# EAGLE design bombclock_1.3 (EAGLE 7.3.0)
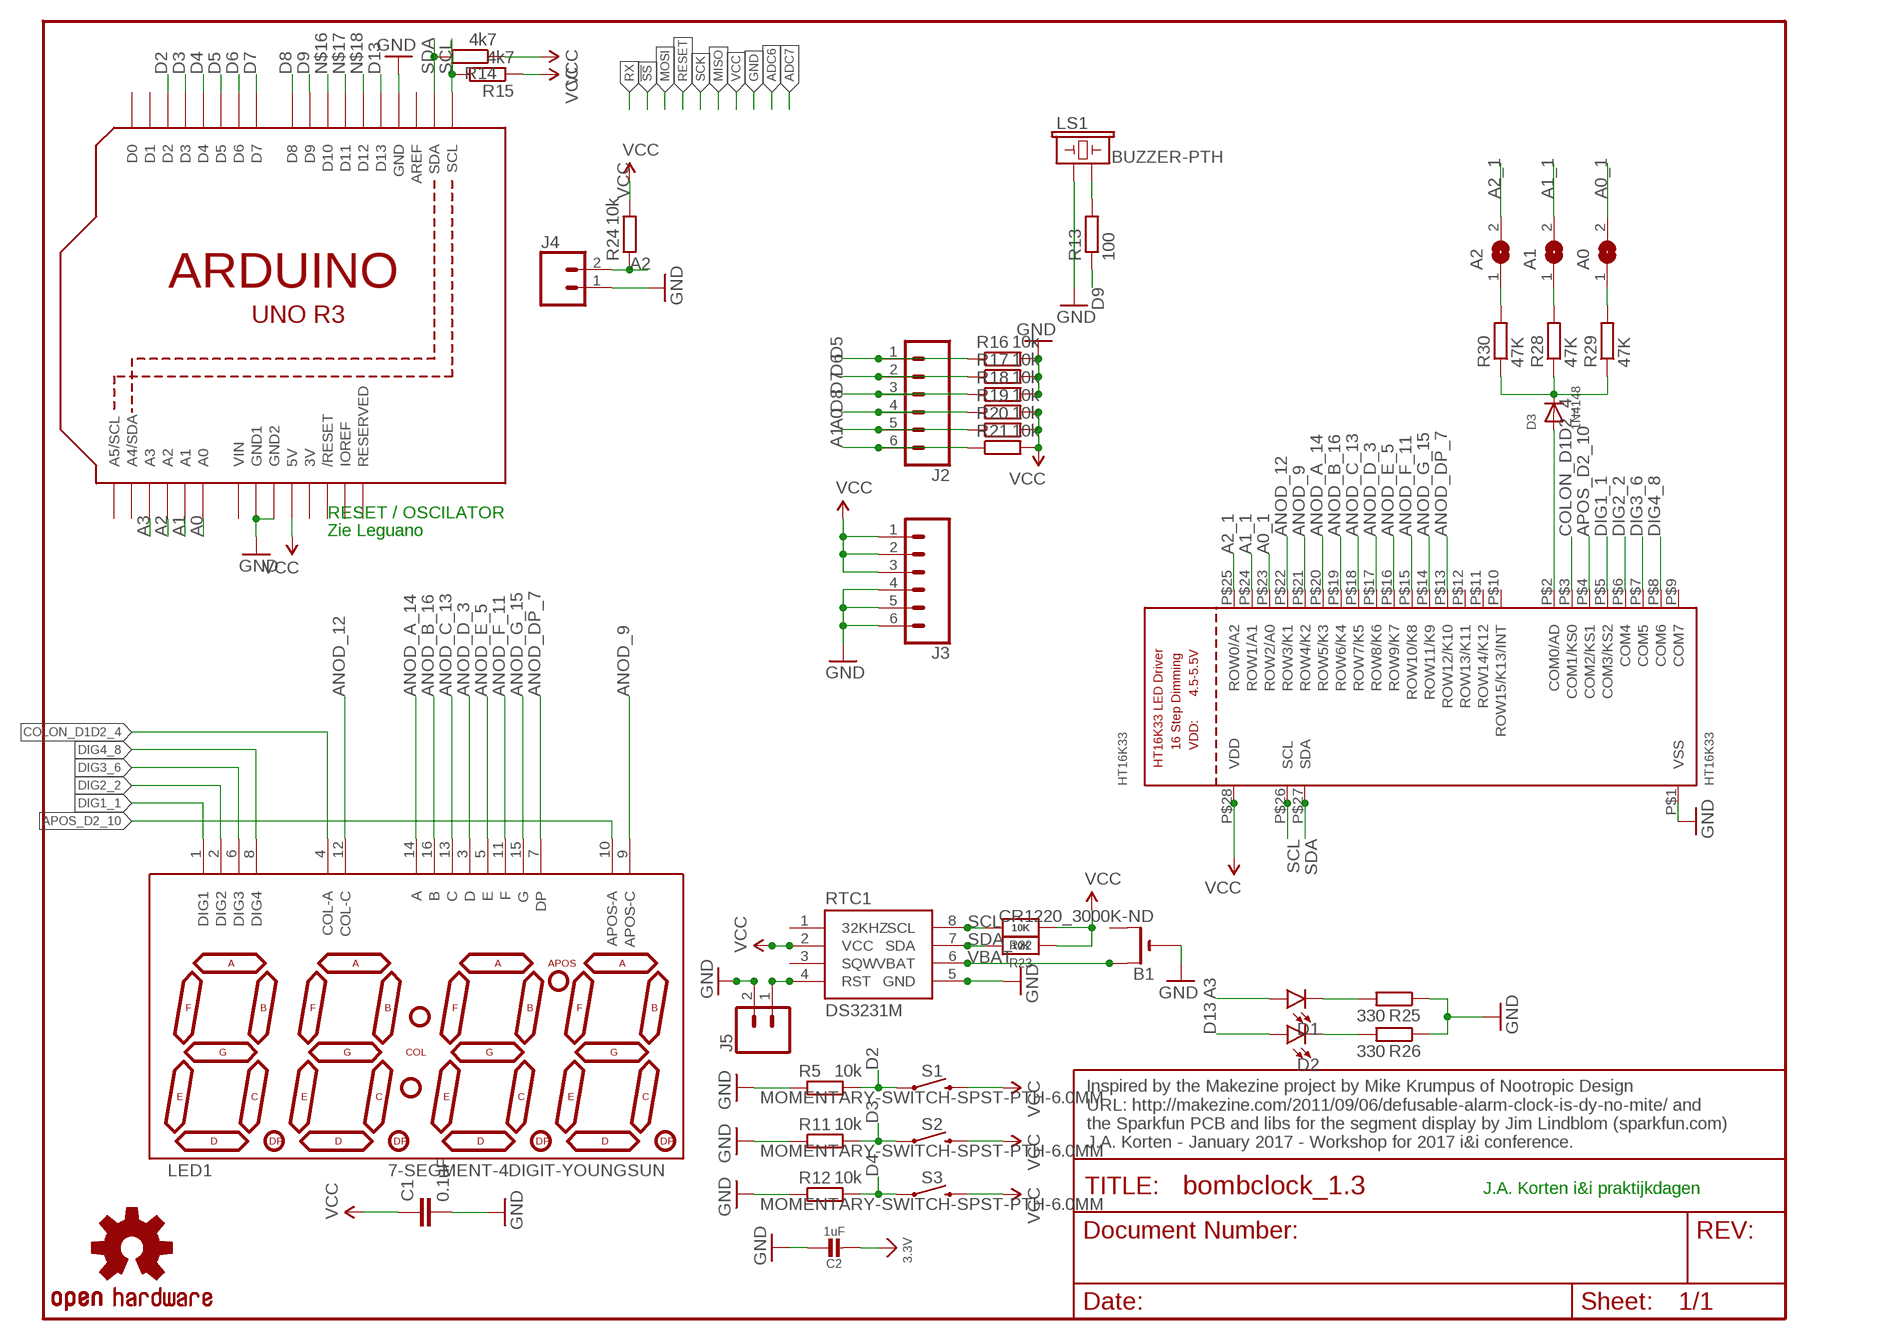
[diagram p0: schematic, sheet 1]

## Parts
A0  SOLDERJUMPERREFLOW_NOPASTE  [SOLDERJUMPER_REFLOW_NOPASTE]
A1  SOLDERJUMPERREFLOW_NOPASTE  [SOLDERJUMPER_REFLOW_NOPASTE]
A2  SOLDERJUMPERREFLOW_NOPASTE  [SOLDERJUMPER_REFLOW_NOPASTE]
B1  CR1220_3000K-ND  CR1220SMT  [CR1220-SMD]
C1  0.1uF  CAP0402-CAP  [0402-CAP]
C2  1uF  CAP_CERAMIC0805-NOOUTLINE  [0805-NO]
D1  LED5MM  [LED_5MM]
D2  LED5MM  [LED_5MM]
D3  1N4148  DIODESOD-323F  [SOD-323F]
HT16K33  HT16K33  HT16K33_SOP28  [SOP28_300MIL]
J2  CONN_06SILK_FEMALE_PTH  [1X06]
J3  CONN_06SILK_FEMALE_PTH  [1X06]
J4  CONN_02  [1X02]
J5  CONN_02  [1X02]
LED1  7-SEGMENT-4DIGIT-YOUNGSUN  [7-SEGMENT-4DIGIT-YOUNGSUN]
LS1  BUZZER-PTH  [BUZZER-12MM]
R5  10k  R-EU_R0603  [R0603]
R11  10k  R-EU_R0603  [R0603]
R12  10k  R-EU_R0603  [R0603]
R13  100  R-EU_R0603  [R0603]
R14  4k7  R-EU_R0603  [R0603]
R15  4k7  R-EU_R0603  [R0603]
R16  10k  R-EU_R0603  [R0603]
R17  10k  R-EU_R0603  [R0603]
R18  10k  R-EU_R0603  [R0603]
R19  10k  R-EU_R0603  [R0603]
R20  10k  R-EU_R0603  [R0603]
R21  10k  R-EU_R0603  [R0603]
R22  10K  RESISTOR0805_NOOUTLINE  [0805-NO]
R23  10K  RESISTOR0805_NOOUTLINE  [0805-NO]
R24  10k  R-EU_R0603  [R0603]
R25  330  R-EU_R0603  [R0603]
R26  330  R-EU_R0603  [R0603]
R28  47K  R-EU_R0603  [R0603]
R29  47K  R-EU_R0603  [R0603]
R30  47K  R-EU_R0603  [R0603]
RTC1  DS3231M  [SO08]
S1  MOMENTARY-SWITCH-SPST-PTH-6.0MM  [TACTILE_SWITCH_PTH_6.0MM]
S2  MOMENTARY-SWITCH-SPST-PTH-6.0MM  [TACTILE_SWITCH_PTH_6.0MM]
S3  MOMENTARY-SWITCH-SPST-PTH-6.0MM  [TACTILE_SWITCH_PTH_6.0MM]
U1  ARDUINOR3-DIMENSION  [ARDUINOR3]
U$4  OSHW-LOGOS  [OSHW-LOGO-S]

## Nets
3.3V: C2.2
A0: J2.5 R20.1 U1.A0
A0_1: A0.2 HT16K33.P$23(ROW2/A0)
A1: J2.6 R21.1 U1.A1
A1_1: A1.2 HT16K33.P$24(ROW1/A1)
A2: J4.2 R24.1 U1.A2
A2_1: A2.2 HT16K33.P$25(ROW0/A2)
A3: D1.A U1.A3
ANOD_9: HT16K33.P$21(ROW4/K2) LED1.9(APOS-C)
ANOD_12: HT16K33.P$22(ROW3/K1) LED1.12(COL-C)
ANOD_A_14: HT16K33.P$20(ROW5/K3) LED1.14(A)
ANOD_B_16: HT16K33.P$19(ROW6/K4) LED1.16(B)
ANOD_C_13: HT16K33.P$18(ROW7/K5) LED1.13(C)
ANOD_D_3: HT16K33.P$17(ROW8/K6) LED1.3(D)
ANOD_DP_7: HT16K33.P$13(ROW12/K10) LED1.7(DP)
ANOD_E_5: HT16K33.P$16(ROW9/K7) LED1.5(E)
ANOD_F_11: HT16K33.P$15(ROW10/K8) LED1.11(F)
ANOD_G_15: HT16K33.P$14(ROW11/K9) LED1.15(G)
APOS_D2_10: HT16K33.P$4(COM2/KS1) LED1.10(APOS-A)
COLON_D1D2_4: HT16K33.P$3(COM1/KS0) LED1.4(COL-A)
D2: R5.2 S1.1 U1.D2
D3: R11.2 S2.1 U1.D3
D4: R12.2 S3.1 U1.D4
D5: J2.1 R16.1 U1.D5
D6: J2.2 R17.1 U1.D6
D7: J2.3 R18.1 U1.D7
D8: J2.4 R19.1 U1.D8
D9: R13.1 U1.D9
D13: D2.A U1.D13
DIG1_1: HT16K33.P$5(COM3/KS2) LED1.1(DIG1)
DIG2_2: HT16K33.P$6(COM4) LED1.2(DIG2)
DIG3_6: HT16K33.P$7(COM5) LED1.6(DIG3)
DIG4_8: HT16K33.P$8(COM6) LED1.8(DIG4)
GND: B1.- C1.2 C2.1 HT16K33.P$1(VSS) J3.4 J3.5 J3.6 J4.1 J5.2 LS1.+ R5.1 R11.1 R12.1 R16.2 R17.2 R18.2 R25.1 R26.1 RTC1.5(GND) U1.GND U1.GND1 U1.GND2
N$1: A0.1 R29.2
N$7: D3.A HT16K33.P$2(COM0/AD)
N$12: D1.K(C) R25.2
N$14: D2.K(C) R26.2
N$16: U1.D10
N$17: U1.D11
N$18: U1.D12
N$19: A1.1 R28.2
N$20: LS1.- R13.2
N$28: D3.C R28.1 R29.1 R30.1
N$29: A2.1 R30.2
PP: J5.1 RTC1.4(RST)
SCL: HT16K33.P$26(SCL) R15.2 R22.2 RTC1.8(SCL) U1.SCL
SDA: HT16K33.P$27(SDA) R14.2 R23.2 RTC1.7(SDA) U1.SDA
VBAT: B1.+$1(+) RTC1.6(VBAT)
VCC: C1.1 HT16K33.P$28(VDD) J3.1 J3.2 J3.3 R14.1 R15.1 R19.2 R20.2 R21.2 R22.1 R23.1 R24.2 RTC1.2(VCC) S1.3 S2.3 S3.3 U1.5V
Unconnected: B1.+$2(+1) HT16K33.P$9(COM7) HT16K33.P$10(ROW15/K13/INT) HT16K33.P$11(ROW14/K12) HT16K33.P$12(ROW13/K11) RTC1.1(32KHZ) RTC1.3(SQW) U1.A4(A4/SDA) U1.A5(A5/SCL) U1.AREF U1.D0 U1.D1 U1.IOREF U1.RESERVED U1.RESET(/RESET)

## Notes on the sheet
- RESET / OSCILATOR
- Zie Leguano
- Inspired by the Makezine project by Mike Krumpus of Nootropic Design 
  URL: http://makezine.com/2011/09/06/defusable-alarm-clock-is-dy-no-mite/ and 
  the Sparkfun PCB and libs for the segment display by Jim Lindblom (sparkfun.com)
  J.A. Korten - January 2017 - Workshop for 2017 i&i conference.
- J.A. Korten i&i praktijkdagen

## Power pins joined to a net without a drawn wire
3V: U1.3V
VIN: U1.VIN

## Library data of the parts
A0 A1 A2 = microbuilder:SOLDERJUMPER: SMD Solder JUMPER Solder the two pads together to create a connection, or remove the solder to break it. REFLOW - Use this footprint for solder paste and reflow ovens. WAVE - Use this footprint for hand-soldering (larger pads). CLOSED - Has a trace between the two pads to ensure it is closed by default. The trace needs to be cut to disable the jumper, and can be closed again by creating a solder bridge between the two pads.
B1 = adafruit:CR1220: CR1216/CR1220/CR1225 12mm 3V lithium coin cell Great for battery packup. Both SMT and THM holders. Note the THM package has the ground pads on both sides of the PCB so that the masks are the same - this reduces the cost
C1 = SparkFun:CAP: Capacitor Standard 0603 ceramic capacitor, and 0.1" leaded capacitor.
C2 = microbuilder:CAP_CERAMIC: Ceramic Capacitors For new designs, use the packages preceded by an '_' character since they are more reliable: The following footprints should be used on most boards: _0402 - Standard footprint for regular board layouts _0603 - Standard footprint for regular board layouts _0805 - Standard footprint for regular board layouts _1206 - Standard footprint for regular board layouts For extremely tight-pitch boards where space is at a premium, the following 'micro-pitch' footprints can be used (smaller pads, no silkscreen outline, etc.): _0402MP - Micro-pitch footprint for very dense/compact boards _0603MP - Micro-pitch footprint for very dense/compact boards _0805MP - Micro-pitch footprint for very dense/compact boards _1206MP - Micro-pitch footprint for very dense/compact boards
D1 D2 = SparkFun-LED:LED: LED (Generic) Standard schematic elements and footprints for 5mm, 3mm, 1206, and 0603 sized LEDs. Generic LEDs with no color specified.
D3 = adafruit:DIODE: Diode SMADIODE - SMA Surface Mount Package 20V 1A Schottky Diode Digikey: 641-1014-6-ND DO-1N4148 - Through Hole Small Current Diode SOD-123 20V 1 A (.5mV Vf) Schottky Diode - Digikey: MBRX120TPMSCT-ND SOD-323 10V 570mA (.38mV Vf, 3ns) Schottky Diode - Digikey: ZLLS410CT-ND SOD-523 30V 30mA Schottky Diode (RB751S-40TE61) - Digikey: RB751S-40TE61CT-ND SOT23-R/W - SOT23 Package (R = Solder Paste/Reflow Ovens, W = Hand-Soldering) BAT54Film 40V 300mA - Digikey: 497-7162-1-ND
HT16K33 = microbuilder:HT16K33_SOP28
J2 J3 = SparkFun-Connectors:CONN_06: Multi connection point. Often used as Generic Header-pin footprint for 0.1 inch spaced/style header connections On any of the 0.1 inch spaced packages, you can populate with these: Break Away Headers - Straight <https://www.sparkfun.com/products/116> (PRT-00116) Break Away Male Headers - Right Angle <https://www.sparkfun.com/products/553> (PRT-00553) Female Headers <https://www.sparkfun.com/products/115> (PRT-00115) Break Away Headers - Machine Pin <https://www.sparkfun.com/products/117> (PRT-00117) Break Away Female Headers - Swiss Machine Pin <https://www.sparkfun.com/products/743> (PRT-00743) Arduino Stackable Header - 6 Pin <https://www.sparkfun.com/products/9280> (PRT-09280) For SCREWTERMINALS and SPRING TERMINALS visit here: Screw Terimnals on SparkFun.com <https://www.sparkfun.com/search/results?term=Screw+Terminals> (5mm/3.5mm/2.54mm spacing) This device is also useful as a general connection point to wire up your design to another part of your project. Our various solder wires solder well into these plated through hole pads. Hook-Up Wire - Assortment (Stranded, 22 AWG) <https://www.sparkfun.com/products/11375> (PRT-11375) Hook-Up Wire - Assortment (Solid Core, 22 AWG) <https://www.sparkfun.com/products/11367> (PRT-11367) View the entire wire category on our website here <https://www.sparkfun.com/categories/141>; PROD_ID: CONN-08437
J4 J5 = SparkFun-Connectors:CONN_02: Multi connection point. Often used as Generic Header-pin footprint for 0.1 inch spaced/style header connections On any of the 0.1 inch spaced packages, you can populate with these: Break Away Headers - Straight <https://www.sparkfun.com/products/116> (PRT-00116) Break Away Male Headers - Right Angle <https://www.sparkfun.com/products/553> (PRT-00553) Female Headers <https://www.sparkfun.com/products/115> (PRT-00115) Break Away Headers - Machine Pin <https://www.sparkfun.com/products/117> (PRT-00117) Break Away Female Headers - Swiss Machine Pin <https://www.sparkfun.com/products/743> (PRT-00743) For SCREWTERMINALS and SPRING TERMINALS visit here: Screw Terimnals on SparkFun.com <https://www.sparkfun.com/search/results?term=Screw+Terminals> (5mm/3.5mm/2.54mm spacing) This device is also useful as a general connection point to wire up your design to another part of your project. Our various solder wires solder well into these plated through hole pads. Hook-Up Wire - Assortment (Stranded, 22 AWG) <https://www.sparkfun.com/products/11375> (PRT-11375) Hook-Up Wire - Assortment (Solid Core, 22 AWG) <https://www.sparkfun.com/products/11367> (PRT-11367) View the entire wire category on our website here <https://www.sparkfun.com/categories/141> Special notes: Molex polarized connector foot print use with: PRT-08233 with associated crimp pins and housings. 2.54_SCREWTERM for use with PRT-10571. 3.5mm Screw Terminal footprints for PRT-08084 5mm Screw Terminal footprints for use with PRT-08432
LED1 = SparkFun:7-SEGMENT-4DIGIT-YOUNGSUN: This is a part for the 4-Digit 7-segment LEDs from Young Sun. Different from the Digikey LEDs, all 16 pins are used. The LONGPADS Variant is used for a test jig, but you may like it because there is more pad to solder to. If you are concerned about routing space, the standard works just fine though.
LS1 = SparkFun-Electromechanical:BUZZER: Buzzer Small round buzzers that operate around the audible 2kHz range. You can use these as speakers to create simple music or user interfaces. Variant Overview: PTH - Mini Speaker - PC Mount 12mm 2.048kHz <https://www.sparkfun.com/products/7950> PTH_KIT - Mini Speaker - PC Mount 12mm 2.048kHz <https://www.sparkfun.com/products/7950> KIT simplifies soldering by adding stop mask to one side of the pads. PTH_NO_SILK - Mini Speaker - PC Mount 12mm 2.048kHz <https://www.sparkfun.com/products/7950> No silkscreen indicator of buzzer outline. PTH_KIT_NO_SILK - Mini Speaker - PC Mount 12mm 2.048kHz <https://www.sparkfun.com/products/7950> KIT package w/o silkscreen SMD - Buzzer Audio Magnetic (CCV-084B16) SMD buzzer used on, e.g. the LilyPad Buzzer <https://www.sparkfun.com/products/8463> and RFID USB Reader <https://www.sparkfun.com/products/9963>. SMD_KIT - Buzzer Audio Magnetic (CCV-084B16) SMD Buzzer with elongated pins to make soldering easier. Used on the SparkFun Simon Says - Surface Mount Soldering Kit <https://www.sparkfun.com/products/10935>.; PROD_ID: COMP-08253; SF_SKU: COM-07950
R5 R11-R21 R24-R26 = rcl:R-EU_: RESISTOR, European symbol
R22 R23 = microbuilder:RESISTOR: Resistors For new designs, use the packages preceded by an '_' character since they are more reliable: The following footprints should be used on most boards: _0402 - Standard footprint for regular board layouts _0603 - Standard footprint for regular board layouts _0805 - Standard footprint for regular board layouts _1206 - Standard footprint for regular board layouts For extremely tight-pitch boards where space is at a premium, the following 'micro-pitch' footprints can be used (smaller pads, no silkscreen outline, etc.): _0402MP - Micro-pitch footprint for very dense/compact boards _0603MP - Micro-pitch footprint for very dense/compact boards _0805MP - Micro-pitch footprint for very dense/compact boards _1206MP - Micro-pitch footprint for very dense/compact boards
R28-R30 = resistor:R-EU_: RESISTOR, European symbol
RTC1 = SparkFun-Clocks:DS3231M: DS3231M Real Time Clock Accuracy +/-5ppm. Battery Backup. 2.3V to 5.5V. Datasheet <https://cdn.sparkfun.com/datasheets/Dev/Beagle/DS3231M.pdf> SparkFun Products CryptoCape <https://www.sparkfun.com/products/12773> (DEV-12773) SparkFun CryptoShield <https://www.sparkfun.com/products/13183> (DEV-13183); PROD_ID: IC-11985
S1-S3 = SparkFun-Switches:MOMENTARY-SWITCH-SPST: Momentary Switch (Pushbutton) - SPST Normally-open (NO) SPST momentary switches (buttons, pushbuttons). Variants PTH-12MM - 12mm square, through-hole Momentary Pushbutton Switch - 12mm Square <https://www.sparkfun.com/products/9190> (COM-09190) PTH-6.0MM, PTH-6.0MM-KIT - 6.0mm square, through-hole Mini Pushbutton Switch <https://www.sparkfun.com/products/97> (COM-00097) KIT package intended for soldering kit's - only one side of pads' copper is exposed. PTH-RIGHT-ANGLE-KIT - Right-angle, through-hole Right Angle Tactile Button <https://www.sparkfun.com/products/10791> - Used on SparkFun BigTime Watch Kit <https://www.sparkfun.com/products/11734> SMD-12MM - 12mm square, surface-mount Tactile Button - SMD (12mm) <https://www.sparkfun.com/products/12993> (COM-12993) Used on SparkFun PicoBoard <https://www.sparkfun.com/products/11888> SMD-4.5MM - 4.5mm Square Trackball Switch Used on SparkFun Blackberry Trackballer Breakout <https://www.sparkfun.com/products/13169> SMD-4.6MMX2.8MM - 4.60mm x 2.80mm, surface mount Used on SparkFun SAMD21 Mini Breakout <https://www.sparkfun.com/products/13664> SMD-5.2MM, SMD-5.2-REDUNDANT - 5.2mm square, surface-mount Mini Pushbutton Switch - SMD <https://www.sparkfun.com/products/8720> (COM-08720) Used on Arduino Pro Mini <https://www.sparkfun.com/products/11114> REDUNDANT package connects both switch circuits together SMD-6.0X3.5MM - 6.0 x 3.5mm, surface mount Momentary Reset Switch SMD <https://www.sparkfun.com/products/8229> (COM-08229) SMD-6.2MM-TALL - 6.2mm square, surface mount Tactile Button - SMD (6mm) <https://www.sparkfun.com/products/12992> Used on SparkFun Digital Sandbox <https://www.sparkfun.com/products/12651> SMD-RIGHT-ANGLE - Right-angle, surface mount Used on SparkFun Block for Intel® Edison - Arduino <https://www.sparkfun.com/products/13036>; PROD_ID: SWCH-08441; SF_SKU: COM-00097
U1 = adafruit:ARDUINOR3: This is a new object for the new Arduino R3 - with extra pins that you may want to use (such as IOref, and duplicated A4/A5
U$4 = SparkFun-Aesthetics:OSHW-LOGO: Open Source Hardware Logo This logo indicates the piece of hardware it is found on incorporates a OSHW license and/or adheres to the definition of open source hardware found here: http://freedomdefined.org/OSHW

## Board
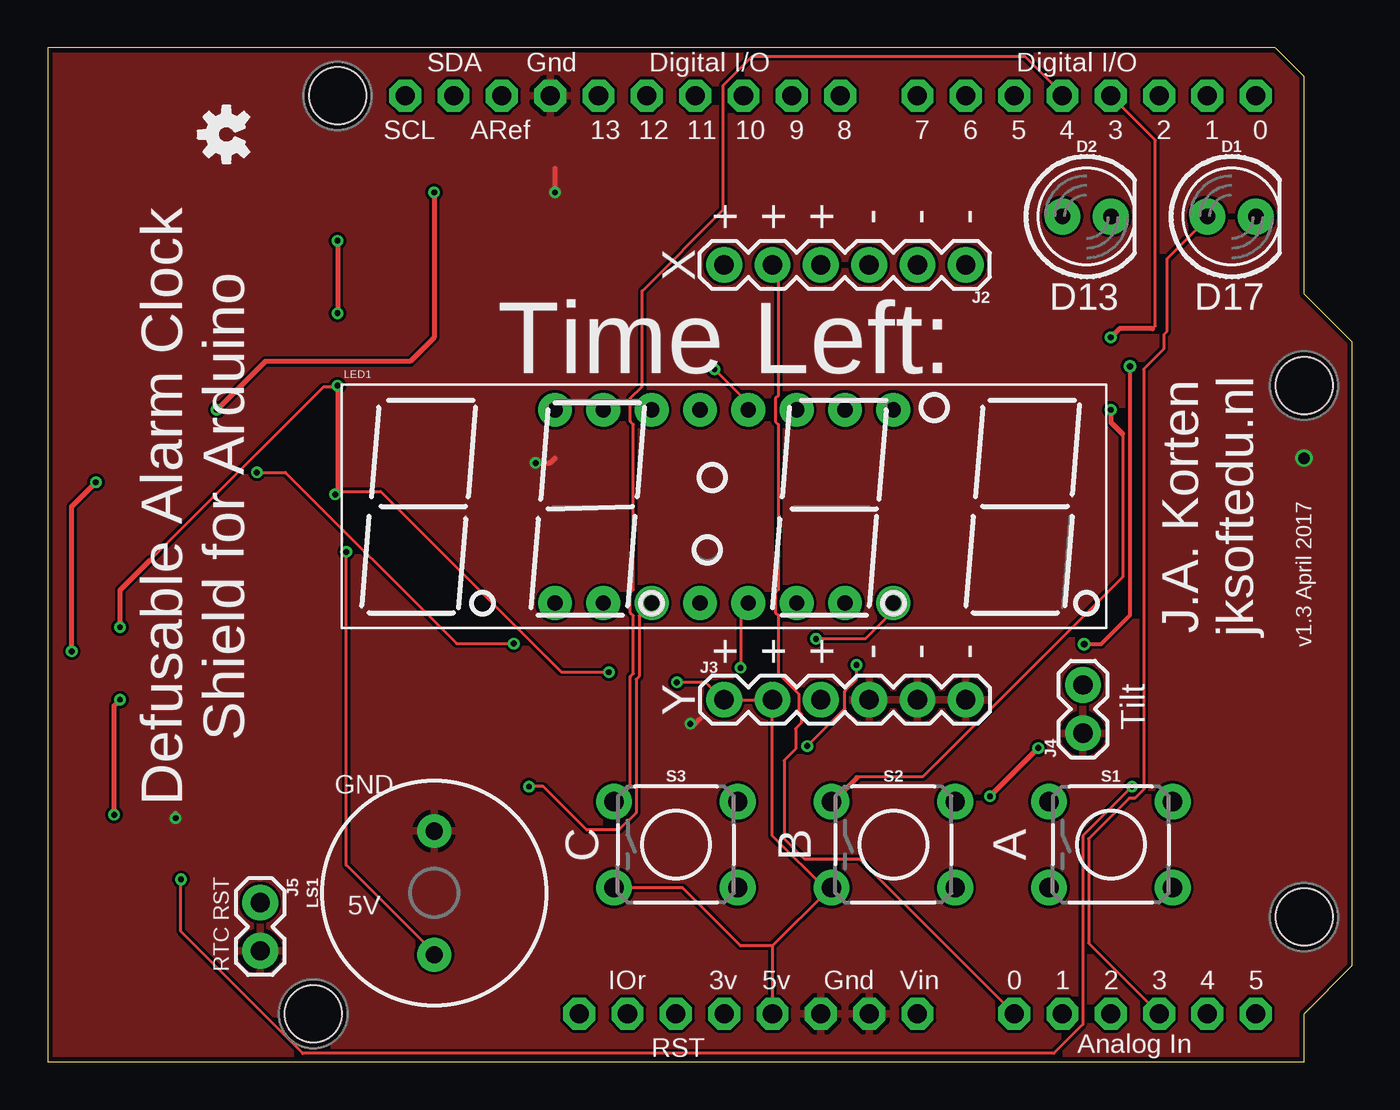
[diagram p1: board, top side]
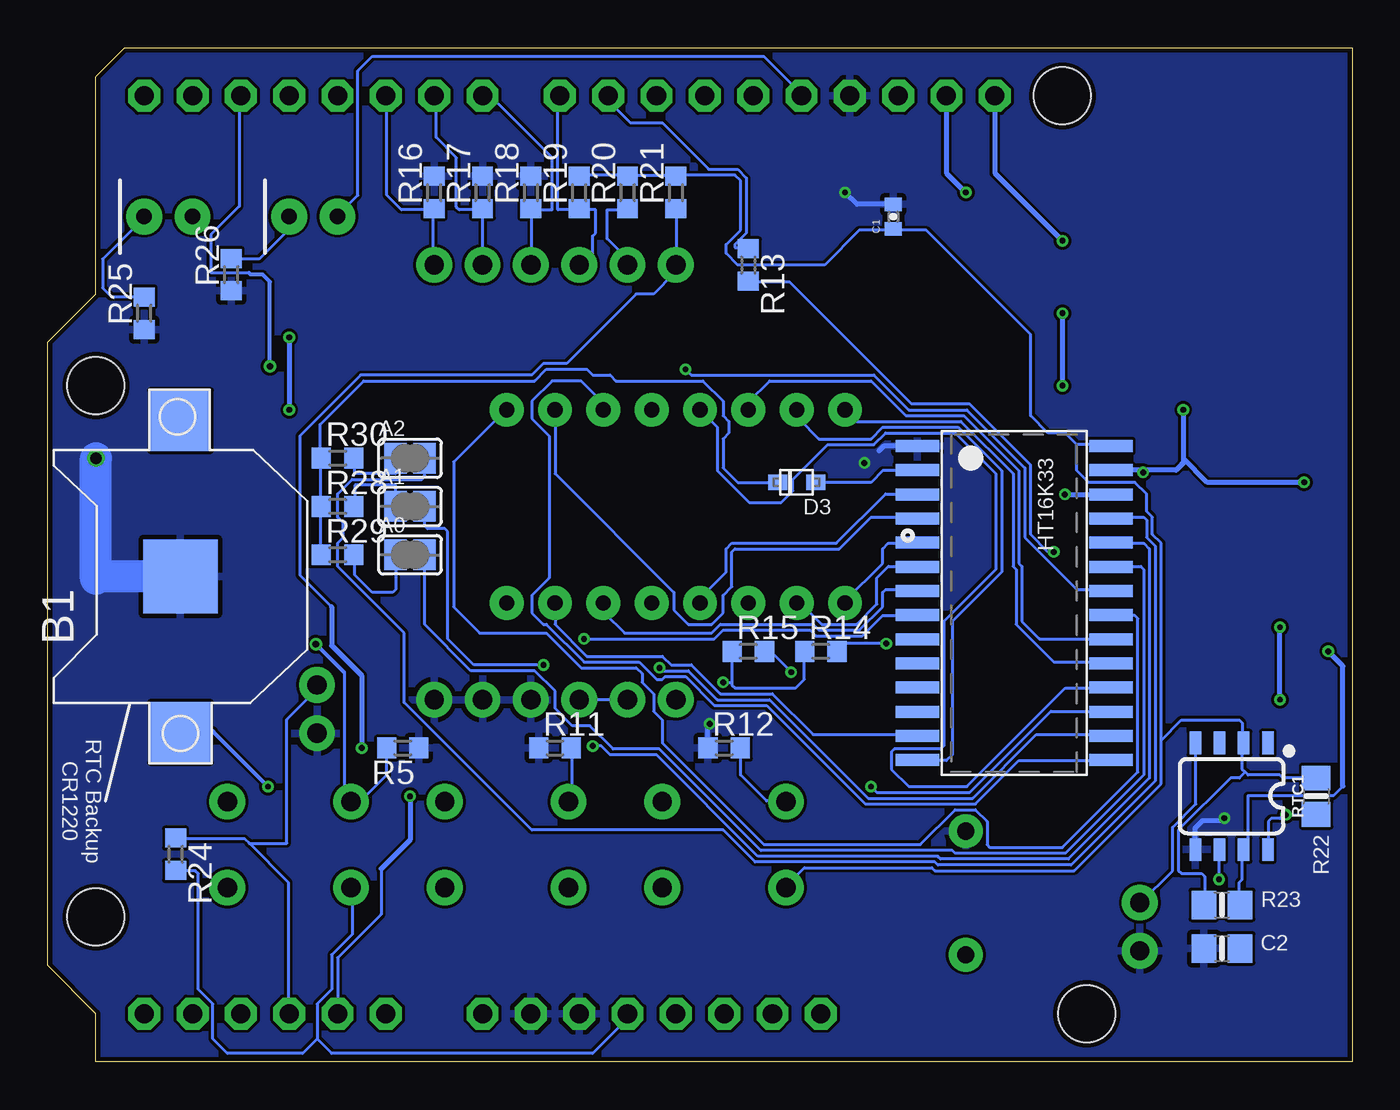
[diagram p2: board, bottom side, seen from below]

Size 68.58 x 53.34 mm. Coordinates in mm from the lower left corner, seen from the top.
Copper layers (1*16): Top 0.035mm / dielectric 1.5mm / Bottom 0.035mm
Design rules "ITEADstudioDRC": minimum track width 6mil, minimum drill 12mil, track to track 6mil, track to pad 6mil, pad to pad 6mil, via to via 6mil, smd to smd 0mil, copper to edge 10mil, drill to drill 10mil, minimum pad ring 10mil, minimum via ring 6mil, stop-mask expansion 2mil, vias tented up to drill 100mil, thermal gap 10mil
Holes 3 mm at 66.04,35.56 66.04,7.62 15.24,50.8 13.97,2.54

### Footprints (pad centres in the part's own frame; a part is rotated, then mirrored left to right if it is on the bottom)
SOLDERJUMPER_REFLOW_NOPASTE = smd 1.168 x 1.6: 1 -0.762,0; 2 0.762,0
CR1220-SMD = smd 3.2 x 3.2: +$1 -8.2,0; +$2 8.2,0 | smd 3.9 x 3.9: - 0,0
0402-CAP = smd 0.7 x 0.9: 1 -0.65,0; 2 0.65,0
0805-NO = smd 1.3 x 1.5: 1 -0.95,0; 2 0.95,0
LED_5MM = drill 0.813 pad 1.88: A -1.27,0; K 1.27,0
SOD-323F = smd 1 x 0.8: A -1,0; C 1,0
SOP28_300MIL = smd 0.635 x 2.286: P$1 -8.255,-5.08; P$2 -6.985,-5.08; P$3 -5.715,-5.08; P$4 -4.445,-5.08; P$5 -3.175,-5.08; P$6 -1.905,-5.08; P$7 -0.635,-5.08; P$8 0.635,-5.08; P$9 1.905,-5.08; P$10 3.175,-5.08; P$11 4.445,-5.08; P$12 5.715,-5.08; P$13 6.985,-5.08; P$14 8.255,-5.08; P$15 8.255,5.08; P$16 6.985,5.08; P$17 5.715,5.08; P$18 4.445,5.08; P$19 3.175,5.08; P$20 1.905,5.08; P$21 0.635,5.08; P$22 -0.635,5.08; P$23 -1.905,5.08; P$24 -3.175,5.08; P$25 -4.445,5.08; P$26 -5.715,5.08; P$27 -6.985,5.08; P$28 -8.255,5.08
1X06 = drill 1.016 pad 1.88: 1 0,0; 2 2.54,0; 3 5.08,0; 4 7.62,0; 5 10.16,0; 6 12.7,0
1X02 = drill 1.016 pad 1.88: 1 0,0; 2 2.54,0
7-SEGMENT-4DIGIT-YOUNGSUN = drill 0.8 pad 1.778: 1 -8.89,-5.08; 2 -6.35,-5.08; 3 -3.81,-5.08; 4 -1.27,-5.08; 5 1.27,-5.08; 6 3.81,-5.08; 7 6.35,-5.08; 8 8.89,-5.08; 9 8.89,5.08; 10 6.35,5.08; 11 3.81,5.08; 12 1.27,5.08; 13 -1.27,5.08; 14 -3.81,5.08; 15 -6.35,5.08; 16 -8.89,5.08
BUZZER-12MM = drill 0.9 pad 1.778: + 3.25,0; - -3.25,0
R0603 = smd 1 x 1.1: 1 -0.85,0; 2 0.85,0
SO08 = smd 0.6 x 1.2: 1 -1.905,-2.8; 2 -0.635,-2.8; 3 0.635,-2.8; 4 1.905,-2.8; 5 1.905,2.8; 6 0.635,2.8; 7 -0.635,2.8; 8 -1.905,2.8
TACTILE_SWITCH_PTH_6.0MM = drill 1.016 pad 1.88: 1 -3.251,2.261; 2 3.251,2.261; 3 -3.251,-2.261; 4 3.251,-2.261
ARDUINOR3 = drill 1 pad 1.676 octagon: 3V 35.56,2.54; 5V 38.1,2.54; A0 50.8,2.54; A1 53.34,2.54; A2 55.88,2.54; A3 58.42,2.54; A4 60.96,2.54; A5 63.5,2.54; AREF 23.876,50.8; D0 63.5,50.8; D1 60.96,50.8; D2 58.42,50.8; D3 55.88,50.8; D4 53.34,50.8; D5 50.8,50.8; D6 48.26,50.8; D7 45.72,50.8; D8 41.656,50.8; D9 39.116,50.8; D10 36.576,50.8; D11 34.036,50.8; D12 31.496,50.8; D13 28.956,50.8; GND 26.416,50.8; GND1 43.18,2.54; GND2 40.64,2.54; IOREF 30.48,2.54; RESERVED 27.94,2.54; RESET 33.02,2.54; SCL 18.796,50.8; SDA 21.336,50.8; VIN 45.72,2.54

### Placement (x,y rotation side)
A0  49.53,26.67 0 bottom
A1  49.53,29.21 0 bottom
A2  49.53,31.75 0 bottom
B1  61.59,25.53 90 bottom
C1  24.13,44.45 90 bottom
C2  6.86,5.97 0 bottom
D1  62.23,44.45 0 top
D2  54.61,44.45 0 top
D3  29.21,30.48 180 bottom
HT16K33  17.78,24.13 270 bottom
J2  48.26,41.91 180 top
J3  35.56,19.05 0 top
J4  54.41,17.29 90 top
J5  11.18,8.38 270 top
LED1  35.56,29.21 0 top
LS1  20.32,8.89 90 top
R5  49.91,16.51 180 bottom
R11  41.91,16.51 0 bottom
R12  33.02,16.51 0 bottom
R13  31.75,41.91 270 bottom
R14  27.94,21.59 0 bottom
R15  31.75,21.59 0 bottom
R16  48.26,45.72 90 bottom
R17  45.72,45.72 90 bottom
R18  43.18,45.72 90 bottom
R19  40.64,45.72 90 bottom
R20  38.1,45.72 90 bottom
R21  35.56,45.72 90 bottom
R22  1.91,13.97 270 bottom
R23  6.86,8.26 0 bottom
R24  61.85,10.92 270 bottom
R25  63.5,39.37 90 bottom
R26  58.93,41.4 90 bottom
R28  53.34,29.21 0 bottom
R29  53.34,26.67 0 bottom
R30  53.34,31.75 0 bottom
RTC1  6.35,13.97 180 bottom
S1  55.88,11.43 0 top
S2  44.45,11.43 0 top
S3  33.02,11.43 0 top
U1  0,0 0 top
U$4  9.4,48.77 90 top

### Tracks (layer width: path | path; a pad name or v marks a point on that pad's centre or on a via)
A0
  Top 0.152: U1.A0 42.67,10.67 39.78,10.67 38.71,11.73 38.71,15.85 39.32,16.46 39.32,17.53 39.62,17.83 39.62,18.29 39.47,18.44 39.47,19.36 38.41,20.42 38.41,23.47 38.25,23.62 38.25,24.69 38.41,24.84 38.41,33.53 38.25,33.68 38.25,34.9 38.41,35.05 38.41,41.6 J2.5
  Bottom 0.152: J2.5 38.1,42.22 39.17,43.28 39.17,44.81 38.1,44.81 R20.1
A0_1
  Bottom 0.152: A0.2 48.77,23.01 46.33,20.57 42.98,20.57 41.91,19.51 41.91,18.59 41,17.68 40.08,17.68 38.86,16.46 36.42,16.46 31.09,11.12 21.03,11.12 20.88,10.97 15.09,10.97 10.97,15.09 10.97,25.91 11.12,26.06 12.65,26.06 HT16K33.P$23
A1  (via drill 0.3)
  Top 0.254: v52.07,16.51 v49.53,13.97
  Bottom 0.152: R21.1 35.51,44.81 35.51,41.91 J2.6 35.66,41.91 35.66,41.45 36.73,40.39 37.64,40.39 41.3,36.73 42.52,36.73 43.13,36.12 52.12,36.12 55.32,32.92 55.32,25.6 53.65,23.93 | U1.A1 53.34,5.49 51.05,7.77 51.05,10.16
  Bottom 0.254: 53.65,23.93 53.65,21.89 52.07,20.32 v52.07,16.51 | v49.53,13.97 49.53,11.68 51.05,10.16
A1_1  (via drill 0.3)
  Top 0.152: v42.52,20.88 42.52,20.12 41.91,19.51 41.91,18.59 v39.93,16.61
  Bottom 0.152: A1.2 48.77,28.19 48.62,28.04 47.7,28.04 47.55,27.89 47.55,22.25 46.18,20.88 v42.52,20.88 | v39.93,16.61 39.47,16.61 39.01,16.15 36.58,16.15 31.24,10.82 21.79,10.82 21.64,10.67 14.94,10.67 10.67,14.94 10.67,26.98 10.97,27.28 12.65,27.28 HT16K33.P$24
A2
  Bottom 0.152: R24.1 61.72,11.73 58.22,11.73 57.99,11.51 | 57.99,11.51 55.93,9.45 55.93,2.59 U1.A2 | J4.2 54.5,19.5 56,18 56,11.5 58,11.5 57.99,11.51
A2_1
  Bottom 0.152: A2.2 48.77,30.79 48.92,30.63 52.58,30.63 53.34,29.87 53.34,28.65 53.03,28.35 53.03,27.58 53.34,27.28 53.34,26.06 49.84,22.55 49.84,18.9 43.13,12.19 33.07,12.19 31.39,10.52 21.95,10.52 21.79,10.36 14.78,10.36 10.36,14.78 10.36,27.13 10.82,27.58 10.82,28.5 10.97,28.65 12.65,28.65 HT16K33.P$25
A3
  Top 0.152: U1.A3 54.71,6.25 54.71,11.73 56.84,13.87 57.15,13.87 57.61,14.33 57.61,36.42 58.67,37.49 58.67,38.25 58.83,38.41 58.83,42.22 60.96,44.35 D1.A
ANOD_9
  Bottom 0.152: HT16K33.P$21 12.65,23.47 11.43,23.47 11.28,23.32 11.28,15.24 15.24,11.28 19.05,11.28 19.2,11.43 19.2,12.65 19.81,13.26 20.88,13.26 22.71,11.43 30.94,11.43 36.27,16.76 36.27,17.98 36.73,18.44 36.73,19.36 37.34,19.96 37.34,20.42 37.64,20.73 40.54,20.73 42.37,22.55 45.87,22.55 47.24,23.93 47.24,31.55 44.5,34.29 LED1.9
ANOD_12  (via drill 0.3)
  Top 0.152: v35.05,36.42 36.73,34.75 36.73,34.29 LED1.12
  Bottom 0.152: v35.05,36.42 34.75,36.12 25.15,36.12 23.32,34.29 20.27,34.29 17.22,31.24 17.22,27.58 14.48,24.84 12.8,24.84 HT16K33.P$22
ANOD_A_14
  Bottom 0.152: HT16K33.P$20 12.8,22.25 16.46,22.25 17.37,23.16 17.37,26.06 17.53,26.21 17.53,31.09 20.42,33.98 23.47,33.98 25.3,35.81 30.63,35.81 31.7,34.75 31.7,34.29 LED1.14
ANOD_B_16
  Bottom 0.152: LED1.16 26.06,33.68 20.57,33.68 17.83,30.94 17.83,26.06 17.68,25.91 17.68,23.01 15.7,21.03 12.8,21.03 HT16K33.P$19
ANOD_C_13
  Bottom 0.152: LED1.13 33.38,33.38 33.38,31.09 31.7,29.41 30.02,29.41 29.41,30.02 29.41,30.63 27.58,32.46 25.15,32.46 24.54,33.07 20.88,33.07 18.75,30.94 18.75,25.91 21.49,23.16 21.49,16.61 21.64,16.46 24.08,16.46 24.23,16.31 24.23,15.39 23.32,14.48 20.27,14.48 15.09,19.66 12.8,19.66 HT16K33.P$18
ANOD_D_3  (via drill 0.3)
  Top 0.152: v25.3,14.48 26.06,14.48 28.35,12.19 30.02,12.19 30.94,13.11 30.94,20.12 31.09,20.27 31.09,23.47 LED1.3
  Bottom 0.152: v25.3,14.48 24.99,14.17 20.12,14.17 15.85,18.44 12.8,18.44 HT16K33.P$17
ANOD_DP_7
  Bottom 0.152: LED1.7 41.91,23.01 40.23,21.34 36.27,21.34 35.81,20.88 34.75,20.88 33.22,19.36 30.48,19.36 28.35,17.22 22.86,17.22 HT16K33.P$13
ANOD_E_5  (via drill 0.3)
  Top 0.152: v36.42,20.73 36.42,23.77 36.73,24.08 LED1.5
  Bottom 0.152: v36.42,20.73 36.27,20.57 34.9,20.57 33.38,19.05 30.63,19.05 25.45,13.87 19.96,13.87 16.61,17.22 12.8,17.22 HT16K33.P$16
ANOD_F_11
  Bottom 0.152: HT16K33.P$15 12.8,15.85 17.53,15.85 19.81,13.56 25.6,13.56 30.79,18.75 33.53,18.75 35.05,20.27 36.12,20.27 36.27,20.12 36.58,20.12 37.49,21.03 40.39,21.03 42.37,23.01 42.52,23.01 43.13,23.62 43.13,24.54 42.22,25.45 42.22,32.92 43.13,33.83 43.13,34.75 42.06,35.81 40.54,35.81 39.47,34.75 39.47,34.29 LED1.11
ANOD_G_15
  Bottom 0.152: HT16K33.P$14 22.86,15.85 21.34,15.85 21.03,16.15 21.03,23.16 18.44,25.76 18.44,31.09 20.73,33.38 24.69,33.38 25.3,32.77 28.04,32.77 29.11,33.83 29.11,34.29 LED1.15
APOS_D2_10
  Bottom 0.152: LED1.10 41.91,30.94 35.66,24.69 35.66,23.77 34.9,23.01 33.68,23.01 33.07,23.62 33.07,24.54 32.61,24.99 32.61,26.82 32.46,26.98 26.98,26.98 25.3,28.65 22.86,28.65 HT16K33.P$4
COLON_D1D2_4
  Bottom 0.152: LED1.4 34.29,24.38 32.92,25.76 32.92,26.98 32.61,27.28 27.13,27.28 24.54,29.87 22.86,29.87 HT16K33.P$3
D2  (via drill 0.35)
  Top 0.152: 52.73,13.72 S1.1
  Top 0.203: v54.48,21.97 55.37,21.97 56.9,23.5 v56.9,36.58
  Bottom 0.152: R5.2 50.75,16.46 50.75,15.09 52.12,13.72 52.58,13.72 S1.1 53,14 53,20.5 | 58,41.5 60,41.5 60,43.5 58.5,45 58.5,50.5 U1.D2
  Bottom 0.203: 53,20.5 53.01,20.5 v54.48,21.97 | v56.9,36.58 56.9,41.02 57.28,41.4 57.9,41.4 58,41.5
D3  (via drill 0.3)
  Top 0.152: U1.D3 58.22,48.46 58.22,38.71 58.06,38.56 | 56.5,33.02 56.5,25.5 46,15 42.5,15 42.54,14.96
  Top 0.254: S2.1 41.27,13.69 42.54,14.96 | 58.06,38.56 56.34,38.56 v55.88,38.1 | v55.88,34.29 55.88,33.64 56.5,33.02
  Bottom 0.152: R11.2 41,16.46 41,13.87 41.15,13.72 S2.1
  Bottom 0.254: v55.88,38.1 v55.88,34.29
D4
  Top 0.152: U1.D4 53.34,50.9 51.36,52.88 37.03,52.88 35.51,51.36 35.51,44.81 31.24,40.54 31.24,35.51 30.63,34.9 30.63,33.68 30.79,33.53 30.79,24.84 30.63,24.69 30.63,23.62 30.79,23.47 30.79,20.42 30.63,20.27 30.63,14.48 29.87,13.72 S3.1
  Bottom 0.152: R12.2 32.16,16.46 32.16,15.09 30.79,13.72 29.87,13.72 S3.1
D5
  Bottom 0.152: 48.31,44.81 48.31,41.91 J2.1 | 48.31,44.81 49.99,44.81 50.75,45.57 50.75,50.75 U1.D5 | 48.31,44.81 R16.1
D6
  Bottom 0.152: J2.2 45.72,44.81 | 45.72,44.81 46.94,44.81 47.09,44.96 47.09,47.55 48.16,48.62 48.16,50.75 U1.D6 | 45.72,44.81 R17.1
D7
  Bottom 0.152: 43.13,44.81 43.13,41.91 J2.3 | 43.13,44.81 42.06,44.81 42.06,47.55 45.26,50.75 45.72,50.75 U1.D7 | 43.13,44.81 R18.1
D8
  Bottom 0.152: J2.4 40.54,41.91 39.93,42.52 39.93,43.43 39.78,43.59 39.78,44.81 40.54,44.81 R19.1 40.69,44.81 41.76,44.81 41.76,50.75 U1.D8
D9
  Bottom 0.152: R13.1 31.85,42.82 32.46,42.82 32.46,42.98 31.85,43.59 31.85,46.48 32.31,46.94 33.83,46.94 36.27,49.38 37.95,49.38 39.01,50.44 39.01,50.75 U1.D9
D13
  Bottom 0.152: U1.D13 28.96,50.9 30.94,52.88 51.51,52.88 52.27,52.12 52.27,45.57 53.34,44.5 D2.A
DIG1_1
  Bottom 0.152: HT16K33.P$5 22.86,27.28 24.38,27.28 24.69,26.98 24.69,26.21 26.67,24.23 LED1.1
DIG2_2
  Bottom 0.152: HT16K33.P$6 22.86,26.06 24.38,26.06 24.99,25.45 24.99,24.08 26.06,23.01 27.89,23.01 29.11,24.23 LED1.2
DIG3_6
  Bottom 0.152: HT16K33.P$7 22.86,24.84 24.54,24.84 24.69,24.69 24.69,23.93 25.91,22.71 28.04,22.71 28.35,23.01 33.22,23.01 33.68,22.55 38.25,22.55 39.32,23.62 39.32,24.08 LED1.6
DIG4_8  (via drill 0.3)
  Top 0.152: v40.39,22.25 42.98,22.25 44.35,23.62 44.35,24.08 LED1.8
  Bottom 0.152: v40.39,22.25 33.53,22.25 33.07,22.71 28.5,22.71 28.19,22.4 25.76,22.4 24.69,23.47 22.86,23.47 HT16K33.P$8
GND  (via drill 0.3, 0.6)
  Top 0.254: v26.67,45.72 26.67,46.99 | v25.65,31.5 26.42,31.5 26.67,31.75 | v33.78,17.78 34.04,17.78 34.29,18.03 | v6.73,12.83 6.73,13.08
  Bottom 0.152: 43.5,19 J3.4 | 41,2.5 U1.GND2
  Bottom 0.254: C1.2 26.05,45.1 v26.67,45.72 | HT16K33.P$1 24.64,32.38 24.89,32.13 | R12.1 33.87,17.69 v33.78,17.78 | RTC1.5 8.26,12.32 7.87,12.7 6.86,12.7 v6.73,12.83
  Bottom 1.676: B1.- 65.91,25.53 66.04,25.4 v66.04,31.75
  pour Bottom: 0,53.34 68.58,53.34 68.58,0 0,0
  pour Top: 0,0 0,53.34 68.58,53.34 68.58,0
N$1
  Bottom 0.152: A0.1 50.29,24.84 50.44,24.69 51.51,24.69 52.43,25.6 52.43,26.67 R29.2
N$7
  Bottom 0.152: D3.A 25.3,30.48 24.69,31.09 22.86,31.09 HT16K33.P$2
N$12
  Bottom 0.152: R25.2 63.55,40.23 65.23,40.23 65.68,40.69 65.68,42.22 63.55,44.35 D1.K
N$14
  Bottom 0.152: R26.2 58.83,42.22 57.45,42.22 55.93,43.74 55.93,44.35 D2.K
N$19
  Bottom 0.152: A1.1 50.29,30.33 52.43,30.33 52.43,29.26 R28.2
N$20  (via drill 0.3)
  Top 0.152: v15.7,26.82 15.7,10.36 20.27,5.79 LS1.-
  Bottom 0.152: v15.7,26.82 16,26.82 16.92,27.74 16.92,31.39 20.12,34.59 23.16,34.59 29.57,41 31.7,41 R13.2
N$28
  Bottom 0.152: R29.1 54.25,26.67 54.25,29.11 R28.1 54.25,29.26 54.25,31.7 R30.1 54.25,31.85 54.25,33.53 51.97,35.81 42.98,35.81 42.37,36.42 40.23,36.42 39.93,36.12 39.01,36.12 38.71,35.81 34.14,35.81 33.07,34.75 33.07,33.98 32.77,33.68 32.77,33.07 33.07,32.77 33.07,31.24 32.31,30.48 D3.C
N$29
  Bottom 0.152: A2.1 50.29,30.94 52.43,30.94 52.43,31.7 R30.2
PP
  Bottom 0.152: RTC1.4 8.23,16.76 8.23,13.56 9.45,12.34 9.45,10.06 11.12,8.38 J5.1
SCL  (via drill 0.3)
  Top 0.152: v29.5,20.5 27,20.5 17.5,30 15,30 v15.11,29.84 | 5.38,26.38 14.5,35.5 15,35.5 v15.24,35.56
  Top 0.254: v15.24,43.18 v15.24,39.37 | v15.24,35.56 15.24,29.97 v15.11,29.84 | v3.5,13 3.5,18.74 v3.81,19.05 | v3.81,22.86 3.81,24.81 5.38,26.38
  Bottom 0.152: 3.5,12.95 1.98,12.95 R22.2 | 3.5,12.95 3.66,12.95 3.81,12.8 4.27,12.8 4.42,12.65 4.42,11.28 RTC1.8 | v29.5,20.5 30.5,21.5 R15.2 | v3.5,13 3.5,12.95
  Bottom 0.254: U1.SCL 18.8,46.74 v15.24,43.18 | v15.24,39.37 v15.24,35.56 | v15.11,29.84 HT16K33.P$26 | v3.81,19.05 v3.81,22.86
SDA  (via drill 0.3)
  Top 0.152: v24.5,22 21.5,22 12.5,31 v11,31
  Top 0.254: v20.32,45.72 20.32,38.1 19.05,36.83 11.43,36.83 v8.89,34.29 | v1.27,21.59 1.27,29.21 v2.54,30.48
  Bottom 0.152: R23.2 5.94,8.38 5.94,9.45 5.79,9.6 5.79,11.12 RTC1.7 5.5,11.5 5.5,14 1,14 0.5,14.5 | v24.5,22 27,22 R14.2 | v11,31 11,31.11 | 9,31.5 8.94,31.44
  Bottom 0.254: U1.SDA 21.34,46.74 v20.32,45.72 | v8.89,34.29 8.89,31.75 | 8.89,31.75 8.89,31.5 8.94,31.44 9.27,31.11 11,31.11 HT16K33.P$27 | 0.5,14.5 0.5,20.82 v1.27,21.59 | v2.54,30.48 7.62,30.48 8.89,31.75
VBAT  (via drill 0.3)
  Top 0.152: v7.01,9.6 7.01,6.86 13.41,0.46 52.88,0.46 54.41,1.98 54.41,11.89 v57,14.48
  Bottom 0.152: v7.01,9.6 7.01,11.12 RTC1.6 | 61.57,17.37 B1.+$1
  Bottom 0.203: 59.89,17.37 v57,14.48
  Bottom 0.254: 61.57,17.37 59.89,17.37
VCC  (via drill 0.3)
  Top 0.152: v33.07,19.96 34.59,19.96 35.51,19.05 J3.1 J3.2 38.1,11.89 41,8.99 | 38.1,6.1 U1.5V | 41,8.99 41.15,9.14 S2.3 41,8.99 | 41,8.99 38.1,6.1 | 38.1,6.1 36.42,6.1 33.38,9.14 29.87,9.14 S3.3
  Bottom 0.152: 38.1,46.63 35.66,46.63 R21.2 35.51,46.63 32.46,46.63 32.16,46.33 32.16,43.74 32.92,42.98 32.92,42.52 32.31,41.91 27.74,41.91 25.91,43.74 24.23,43.74 C1.1 24.08,43.74 22.4,43.74 16.92,38.25 16.92,33.98 16,33.07 15.09,33.07 14.48,32.46 | 38.1,46.63 40.54,46.63 R19.2 | 38.1,46.63 R20.2 | 14.48,32.46 12.8,32.46 HT16K33.P$28 | 54.41,1.22 55.17,0.46 59.13,0.46 59.89,1.22 59.89,3.05 60.66,3.81 60.66,9.91 60.81,10.06 61.72,10.06 R24.2 | 54.41,1.22 54.41,3.05 53.65,3.81 53.65,5.64 52.58,6.71 52.58,9.14 S1.3 | 32.61,19.96 32.61,21.49 R15.1 | 32.61,19.96 32.61,19.81 32.46,19.66 29.26,19.66 28.8,20.12 28.8,21.49 R14.1 | v33.07,19.96 32.61,19.96 | J3.2 J3.3 | 5.64,15.24 5.49,15.09 3.81,15.09 3.66,14.94 1.98,14.94 R22.1 | 5.64,15.24 5.79,15.39 5.79,16.76 RTC1.2 5.79,16.92 5.79,17.83 5.94,17.98 8.99,17.98 10.06,16.92 | 5.64,15.24 5.94,14.94 6.4,14.94 9.14,12.19 9.14,10.06 8.99,9.91 7.92,9.91 7.77,9.75 7.77,8.38 R23.1 | 10.06,16.92 10.06,14.63 14.63,10.06 21.95,10.06 22.1,10.21 28.8,10.21 29.72,9.3 S3.3 | 54.41,1.22 53.65,0.46 39.93,0.46 38.1,2.29 U1.5V | 14.48,32.46 14.48,31.09 13.87,30.48 11.43,30.48 10.82,29.87 10.82,28.96 10.52,28.65 10.52,27.74 10.06,27.28 10.06,16.92

### Text on the board
_tsilk: + | + | + | - | - | - | X | D13 | D17 | Time Left: | Defusable Alarm Clock / Shield for Arduino | J.A. Korten / jksoftedu.nl | v1.3 April 2017 | + | + | + | - | - | - | Y | Tilt | GND | C | B | A | 5V | RTC RST
_bsilk: RTC Backup / CR1220